# Altium schematic sheet Laboratoire3_ClavierI2C.SchDoc
size Letter; Organization: Cegep Limoilou; Address1: 1300, 8e Avenue; Address2: Québec, QC; Address3: Canada; Address4: G1J 5L5; Revision: Révision?; SheetNumber: ?; SheetTotal: ?; Conception: Conception?; Titre: Titre?; Modification: Modification?
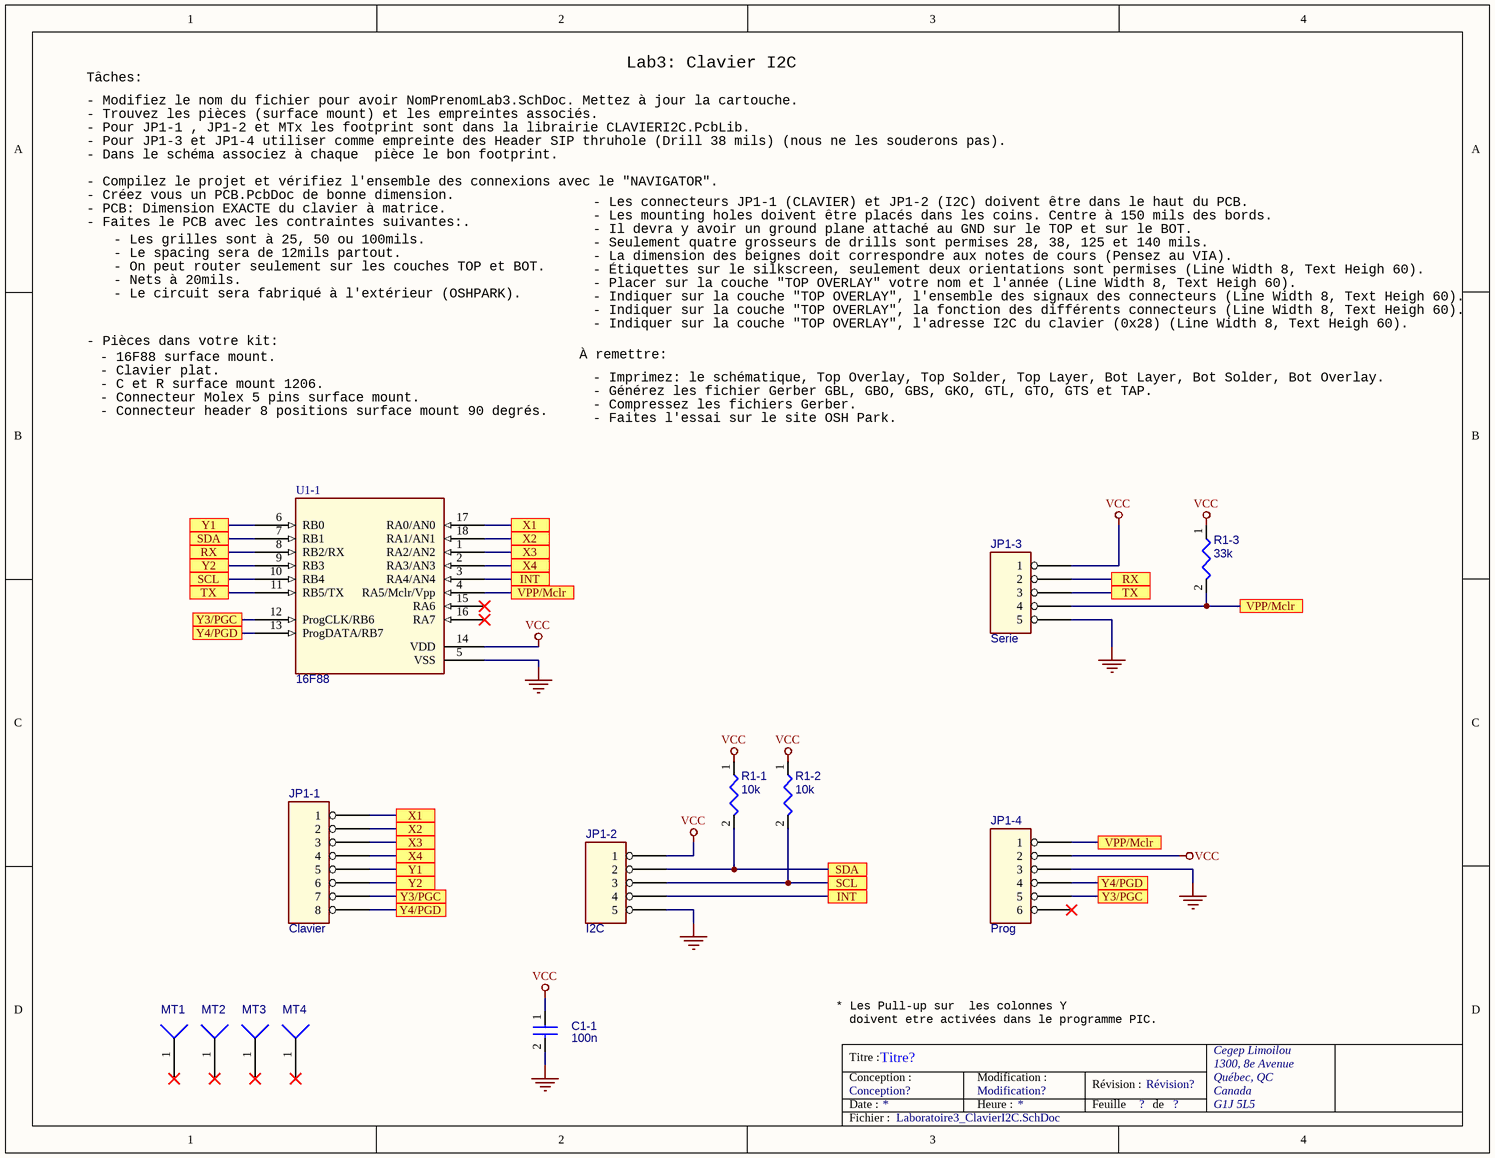
[diagram p0: Laboratoire3_ClavierI2C.SchDoc]

## Parts
C1-1  100n
JP1-1  Clavier
JP1-2  I2C
JP1-3  Serie
JP1-4  Prog
MT1  MT  (value not drawn)
MT2  MT  (value not drawn)
MT3  MT  (value not drawn)
MT4  MT  (value not drawn)
R1-1  10k
R1-2  10k
R1-3  33k
U1-1  16F88

## Ports
INT, RX, SCL, SDA, TX, VPP/Mclr, X1, X2, X3, X4, Y1, Y2, Y3/PGC, Y4/PGD

## Nets
GND: C1-1.2 JP1-2.5 JP1-3.5 JP1-4.3 U1-1.5(VSS)
VCC: C1-1.1 JP1-2.1 JP1-3.1 JP1-4.2 R1-1.1 R1-2.1 R1-3.1 U1-1.14(VDD)
INT: JP1-2.4 U1-1.3(RA4/AN4) ; port INT
RX: JP1-3.2 U1-1.8(RB2/RX) ; port RX
SCL: JP1-2.3 R1-2.2 U1-1.10(RB4) ; port SCL
SDA: JP1-2.2 R1-1.2 U1-1.7(RB1) ; port SDA
TX: JP1-3.3 U1-1.11(RB5/TX) ; port TX
VPP/Mclr: JP1-3.4 JP1-4.1 R1-3.2 U1-1.4(RA5/Mclr/Vpp) ; port VPP/Mclr
X1: JP1-1.1 U1-1.17(RA0/AN0) ; port X1
X2: JP1-1.2 U1-1.18(RA1/AN1) ; port X2
X3: JP1-1.3 U1-1.1(RA2/AN2) ; port X3
X4: JP1-1.4 U1-1.2(RA3/AN3) ; port X4
Y1: JP1-1.5 U1-1.6(RB0) ; port Y1
Y2: JP1-1.6 U1-1.9(RB3) ; port Y2
Y3/PGC: JP1-1.7 JP1-4.5 U1-1.12(ProgCLK/RB6) ; port Y3/PGC
Y4/PGD: JP1-1.8 JP1-4.4 U1-1.13(ProgDATA/RB7) ; port Y4/PGD

Not connected (* = marked no-connect by the designer): JP1-4 6*; MT1 1(A)*; MT2 1(A)*; MT3 1(A)*; MT4 1(A)*; U1-1 15(RA6)* 16(RA7)*

## Notes on the sheet
- Tâches:
- Lab3: Clavier I2C
- - Trouvez les pièces (surface mount) et les empreintes associés.
- - Dans le schéma associez à chaque  pièce le bon footprint.
- - Modifiez le nom du fichier pour avoir NomPrenomLab3.SchDoc. Mettez à jour la cartouche.
- - Pour JP1-3 et JP1-4 utiliser comme empreinte des Header SIP thruhole (Drill 38 mils) (nous ne les souderons pas).
- - Pour JP1-1 , JP1-2 et MTx les footprint sont dans la librairie CLAVIERI2C.PcbLib.
- - Compilez le projet et vérifiez l'ensemble des connexions avec le "NAVIGATOR".
- - PCB: Dimension EXACTE du clavier à matrice.
- - Faites le PCB avec les contraintes suivantes:.
- - Créez vous un PCB.PcbDoc de bonne dimension.
- - Il devra y avoir un ground plane attaché au GND sur le TOP et sur le BOT.
- - Les mounting holes doivent être placés dans les coins. Centre à 150 mils des bords.
- - Les connecteurs JP1-1 (CLAVIER) et JP1-2 (I2C) doivent être dans le haut du PCB.
- - Nets à 20mils.
- - Les grilles sont à 25, 50 ou 100mils.
- - On peut router seulement sur les couches TOP et BOT.
- - Le circuit sera fabriqué à l'extérieur (OSHPARK).
- - Le spacing sera de 12mils partout.
- - Étiquettes sur le silkscreen, seulement deux orientations sont permises (Line Width 8, Text Heigh 60).
- - Seulement quatre grosseurs de drills sont permises 28, 38, 125 et 140 mils.
- - La dimension des beignes doit correspondre aux notes de cours (Pensez au VIA).
- - Indiquer sur la couche "TOP OVERLAY", l'ensemble des signaux des connecteurs (Line Width 8, Text Heigh 60).
- - Placer sur la couche "TOP OVERLAY" votre nom et l'année (Line Width 8, Text Heigh 60).
- - Pièces dans votre kit:
- - 16F88 surface mount.
- À remettre:
- - Indiquer sur la couche "TOP OVERLAY", la fonction des différents connecteurs (Line Width 8, Text Heigh 60).
- - Indiquer sur la couche "TOP OVERLAY", l'adresse I2C du clavier (0x28) (Line Width 8, Text Heigh 60).
- - Clavier plat.
- - Connecteur Molex 5 pins surface mount.
- - C et R surface mount 1206.
- - Connecteur header 8 positions surface mount 90 degrés.
- - Imprimez: le schématique, Top Overlay, Top Solder, Top Layer, Bot Layer, Bot Solder, Bot Overlay.
- - Faites l'essai sur le site OSH Park.
- - Générez les fichier Gerber GBL, GBO, GBS, GKO, GTL, GTO, GTS et TAP.
- - Compressez les fichiers Gerber.
- * Les Pull-up sur  les colonnes Y
- doivent etre activées dans le programme PIC.
- Titre :
- Conception :
- Date :
- Modification :
- Heure :
- Révision :
- Feuille
- de
- Fichier :

## Library data of the parts
C1-1 = CAP NP
JP1-1 = HEADER 8
JP1-2 JP1-3 = HEADER 5
JP1-4 = HEADER 6
MT1-MT4 = CONNECTOR COAX-F
R1-1-R1-3 = R